# EAGLE design sensor_59mm (EAGLE 5.10)
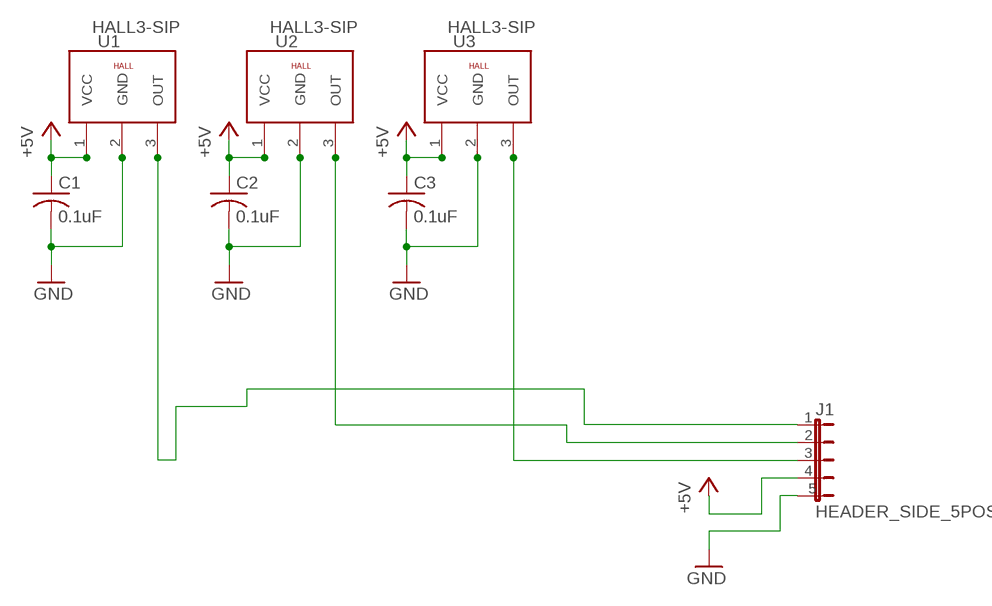
[diagram p0: schematic, sheet 1]

## Parts
C1  0.1uF  C-USC0603  [C0603]
C2  0.1uF  C-USC0603  [C0603]
C3  0.1uF  C-USC0603  [C0603]
J1  HEADER_SIDE_5POS  [HEADER_SIDE_5POS]
U1  HALL3-SIP  [3PINS1,27]
U2  HALL3-SIP  [3PINS1,27]
U3  HALL3-SIP  [3PINS1,27]

## Nets
+5V: C1.1 C2.1 C3.1 J1.4 U1.1(VCC) U2.1(VCC) U3.1(VCC)
GND: C1.2 C2.2 C3.2 J1.5 U1.2(GND) U2.2(GND) U3.2(GND)
N$2: J1.1 U1.3(OUT)
N$4: J1.3 U3.3(OUT)
N$7: J1.2 U2.3(OUT)

## Library data of the parts
C1-C3 = rcl:C-US: CAPACITOR, American symbol
J1 = sc_usercreated:HEADER_SIDE_5POS
U1-U3 = charleses_parts_bin:HALL

## Board
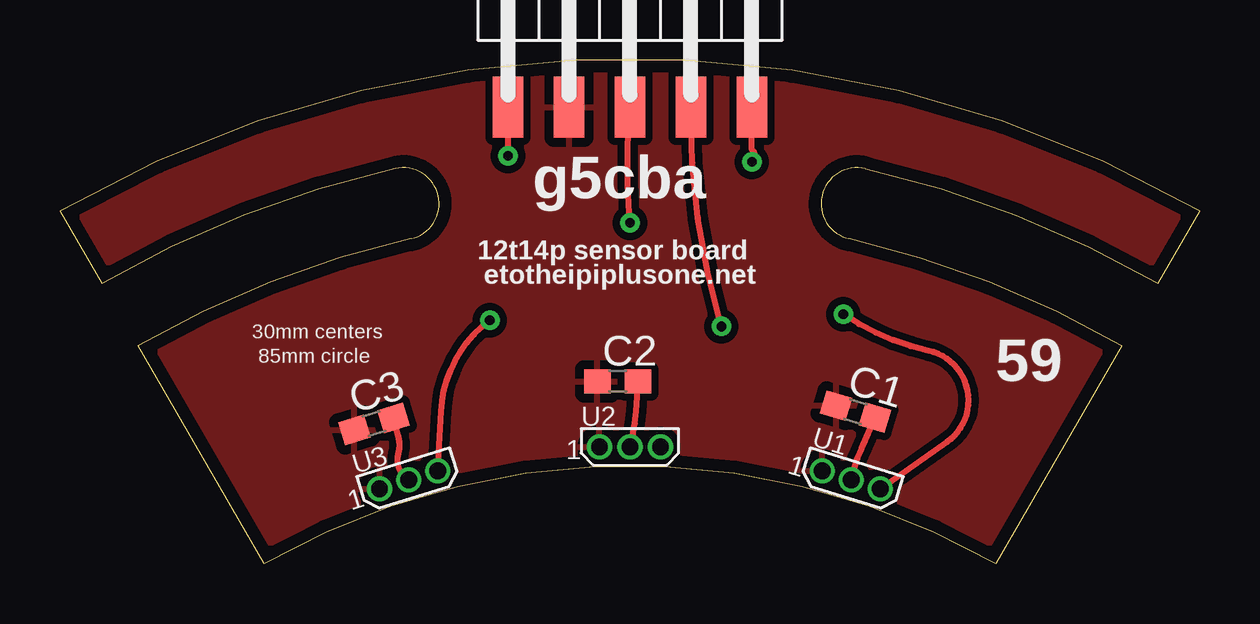
[diagram p1: board, top side]
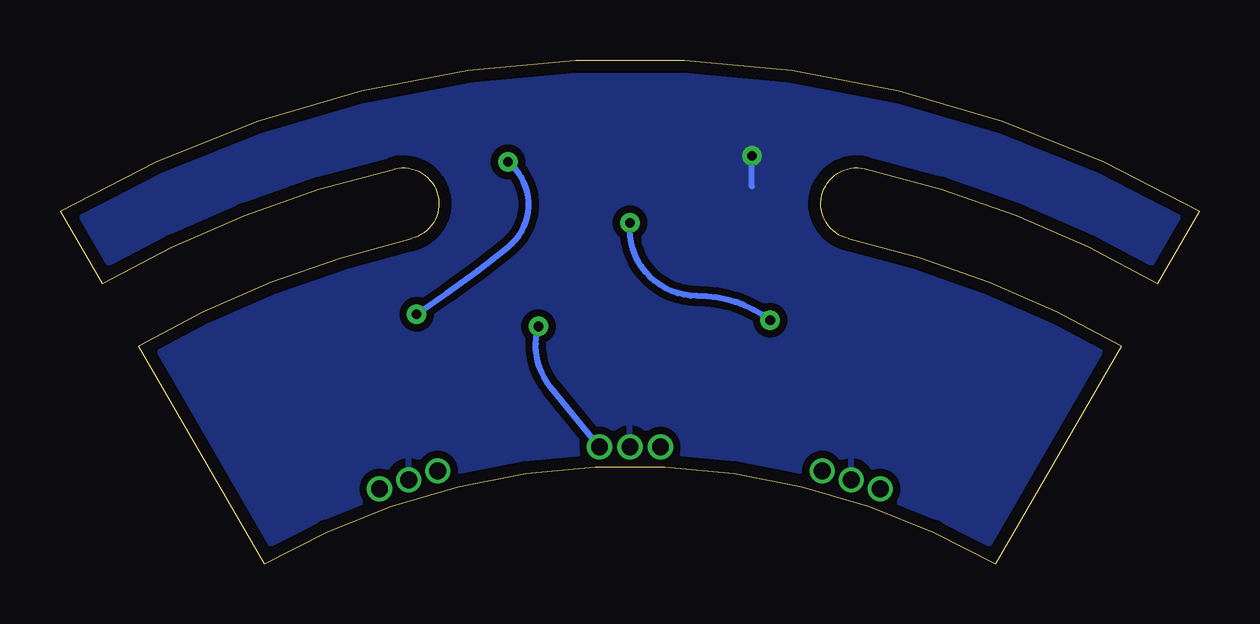
[diagram p2: board, bottom side, seen from below]

Size 47.5 x 21.02 mm. Coordinates in mm from the lower left corner, seen from the top.
Outline: 32.87,13.56 arc-17 44.25,9.09 38.99,0 arc60 8.51,0 3.25,9.09
Outline: 33.55,16.47 arc-17 45.74,11.68 47.5,14.71 arc60 0,14.71 1.75,11.68
Outline: 33.55,16.49 arc180 32.87,13.56
Outline: 1.75,11.69 arc-17 13.97,16.49 arc-180 14.63,13.56 arc17 3.25,9.1
Copper layers (1*16): Top 0.035mm / dielectric 1.5mm / Bottom 0.035mm
Design rules "charlesg_1oz *": minimum track width 10mil, minimum drill 16mil, track to track 6mil, track to pad 6mil, pad to pad 6mil, via to via 6mil, smd to smd 6mil, copper to edge 20mil, drill to drill 8mil, minimum pad ring 6mil, minimum via ring 8mil, stop-mask expansion 4mil, vias tented up to drill 0mil, thermal gap 15mil

### Footprints (pad centres in the part's own frame; a part is rotated, then mirrored left to right if it is on the bottom)
C0603 = smd 1.1 x 1: 1 -0.85,0; 2 0.85,0
HEADER_SIDE_5POS = smd 2.54 x 1.27: 1 0,5.08; 2 0,2.54; 3 0,0; 4 0,-2.54; 5 0,-5.08
3PINS1,27 = drill 0.7 pad 1.016 round: 1 -1.27,0; 2 0,0; 3 1.27,0

### Placement (x,y rotation side)
C1  33.15,6.35 342.9 top
C2  23.24,7.62 0 top
C3  13.08,5.84 17.1 top
J1  23.75,19.05 270 top
U1  32.97,3.51 342.9 top
U2  23.75,4.88 0 top
U3  14.53,3.51 17.1 top

### Tracks (layer width: path | path; a pad name or v marks a point on that pad's centre or on a via)
+5V
  pour Top (isolate 0.305): -0.13,21.08 0.13,0 47.88,0 47.62,21.08
GND  (via drill 0.41 pad 0.81)
  Top 0.254: v18.67,17.02 J1.5 | C3.2 14.1,5.33 arc-30 14.1,4.57 arc74 U3.2 | C2.2 24,6.35 arc-12 U2.2 | C1.2 33.4,4.83 arc11 U1.2
  Bottom 0.254: 18.67,15.75 v18.67,17.02
  pour Bottom (isolate 0.305): -0.13,21.08 -0.13,0 47.62,0 47.62,21.08
N$2  (via drill 0.41 pad 0.81)
  Top 0.254: U1.3 36.96,5.08 arc132 36.2,8.89 arc-21 v32.64,10.41 | v28.83,16.76 arc103 28.83,17.27 J1.1
  Bottom 0.254: v32.64,10.41 arc-5 28.83,13.21 arc-103 v28.83,16.76
N$4  (via drill 0.41 pad 0.81)
  Top 0.254: U3.3 15.88,6.35 arc-50 v17.91,10.16 | v23.75,14.22 arc-10 J1.3
  Bottom 0.254: v17.91,10.16 arc-37 20.95,11.18 arc95 v23.75,14.22
N$7  (via drill 0.41 pad 0.81)
  Top 0.254: v27.56,9.91 arc-17 J1.2
  Bottom 0.254: U2.3 27.05,7.37 arc56 v27.56,9.91

### Text on the board
tPlace: g5cba | 12t14p sensor board | etotheipiplusone.net | 30mm centers | 85mm circle | 59